# Altium schematic sheet Xbee.SchDoc
size A4
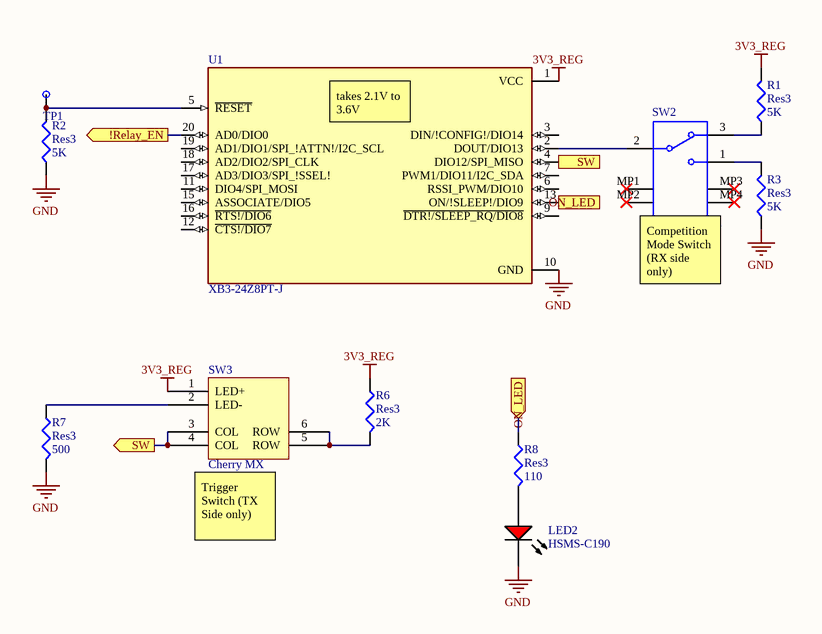
[diagram p0: Xbee.SchDoc]

## Parts
LED2  HSMS-C190  [AVAG-HSMX-C190_V]
R1  Res3  value 5K  [RESC1608X06N_0603]
R2  Res3  value 5K  [RESC1608X06N_0603]
R3  Res3  value 5K  [RESC1608X06N_0603]
R6  Res3  value 2K  [RESC1608X06N_0603]
R7  Res3  value 500  [RESC1608X06N_0603]
R8  Res3  value 110  [RESC1608X06N_0603]
SW2  PCM12SMTR  [CKCP-PCM12SMTR_V]
SW3  Cherry MX  [Cherry MX]
TP1  TestPt  [50_MIL_PAD]  (value not drawn)
U1  XB3-24Z8PT-J  [XCVR_XB3-24Z8PT-J]

## Ports
!Relay_EN (out), ON_LED (in), ON_LED (out), SW (in), SW (out)

## Nets
3V3_REG: R1.2 R6.1 SW3.1(LED+) U1.1(VCC)
GND: LED2.2(K) R2.1 R3.1 R7.2 U1.10(GND)
!Relay_EN: U1.20(AD0/DIO0) ; port !Relay_EN
ON_LED: R8.1 U1.13(ON/!SLEEP!/DIO9) ; port ON_LED
SW: SW3.3(COL) SW3.4(COL) U1.4(DIO12/SPI_MISO) ; port SW
NetLED2_1: LED2.1(A) R8.2
NetR1_1: R1.1 SW2.3
NetR2_2: R2.2 TP1.1 U1.5(~{RESET})
NetR3_2: R3.2 SW2.1
NetR6_2: R6.2 SW3.5(ROW) SW3.6(ROW)
NetR7_1: R7.1 SW3.2(LED-)
NetSW2_2: SW2.2 U1.2(DOUT/DIO13)

Not connected (* = marked no-connect by the designer): SW2 MP1* MP2* MP3* MP4*; U1 3(DIN/!CONFIG!/DIO14) 6(RSSI_PWM/DIO10) 7(PWM1/DIO11/I2C_SDA) 9(~{DTR!/SLEEP_RQ/DIO8}) 11(DIO4/SPI_MOSI) 12(~{CTS!/DIO7}) 15(ASSOCIATE/DIO5) 16(~{RTS!/DIO6}) 17(AD3/DIO3/SPI_!SSEL!) 18(AD2/DIO2/SPI_CLK) 19(AD1/DIO1/SPI_!ATTN!/I2C_SCL)

## Notes on the sheet
- (near U1) takes 2.1V to 3.6V
- (near SW2) Competition Mode Switch (RX side only)
- (near SW3) Trigger Switch (TX Side only)

## Library data of the parts
LED2 = CMP-2000-06427-1: LED Uni-Color Red, 52 mW, 20 mA, -40 to 85 degC, 2-Pin SMD, RoHS, Tape and Reel; Manufacturer: Avago; Reverse Voltage: 5V; Viewing Angle: 170deg; High Brightness: No; Lens Type: ColorlessDiffused; DELETED: Compliant; Product Height (mm): 0.8mm; Dominant Wave Length: 626nm; Number of  Elements: 1; Chip Material: GaP; Lum Intensity: 10mcd; Product Length (mm): 1.6mm; Forward Voltage: 2.6V; Power Dissipation: 52W; Shape Type: Rectangular; Forward Current: 25mA; Peak Wavelength: 630nm; Test Current (It): 20mA; Main Category: ChipLED; Lens Dimensions: 1x0.8x0.5mm; Pin Count: 2; Package Reference: HSMX-C190; Mounting Technology: SurfaceMount; Mounting: SurfaceMount; Datasheet URL: http://docs.avagotech.com/docs/AV02-0551EN; Package Type: ChipLed; Operating Temperature Classification: Industrial; Datasheet Version: 03/2012; Operating Temp Range: -40Cto85C; Emitting Color: Red; Rad Hardened: No; Manufacturer URL: http://www.avagotech.com/; Luminous Intensity: 10mcd; Package Description: 2-Pin Surface Mount Device, Body 1.6 x 0.8 mm, Height 0.9 mm; Type: Uni-Color; Packaging: TapeandReel; Product Depth (mm): 0.8mm
R1-R3 R6-R8 = Res3: Resistor; Published: 8-Jun-2000; LatestRevisionDate: 29-May-2009; LatestRevisionNote: IPC-7351 Footprint Added.; PackageReference: J1-0603; Publisher: Altium Limited; PackageDescription: Chip Resistor
SW2 = CMP-2000-06884-1: Ultraminiature Slide Switch, SPDT, 0.3 A, 6 V, -20 to 85 degC, 3-Pin SMD, RoHS, Tape and Reel; Manufacturer: C&K Components; Switch Operation: On-On; Contact Current-Max: 0.3A; Datasheet Version: 02/2016; Package Reference: PCM12SMTR; Package Description: 3-Pin Surface Mount Device, Body 6.7 x 2.6 mm; Contact Material: SilverOverCopper; Mounting Technology: SurfaceMount; Circuitry: SPDT; Datasheet URL: http://www.ck-components.com/media/1424/pcm.pdf; Termination Style: RightAngle/SurfaceMount; Manufacturer URL: http://www.ckswitches.com/
SW3 = Cherry MX: Mechanical Switch with LED / https://media.digikey.com/pdf/Data%20Sheets/Cherry%20PDFs/MX%20Series.pdf
U1 = XB3-24Z8PT-J: 802.15.4 ZigbeeÂ® Transceiver Module 2.4GHz Integrated, Trace Through Hole / https://www.digi.com/resources/documentation/digidocs/pdfs/90001543.pdf; MF: Digi International; Value: *; Digi-Key_Purchase_URL: https://www.digikey.ch/product-detail/en/digi/XB3-24Z8PT-J/602-2188-ND/8130934?utm_source=snapeda&utm_medium=aggregator&utm_campaign=symbol; MP: XB3-24Z8PT-J; Package: Module Digi International; SnapEDA_Link: https://www.snapeda.com/parts/XB3-24Z8PT-J/Digi%20International/view-part/2751315/?ref=snap; Digi-Key_Part_Number: 602-2188-ND